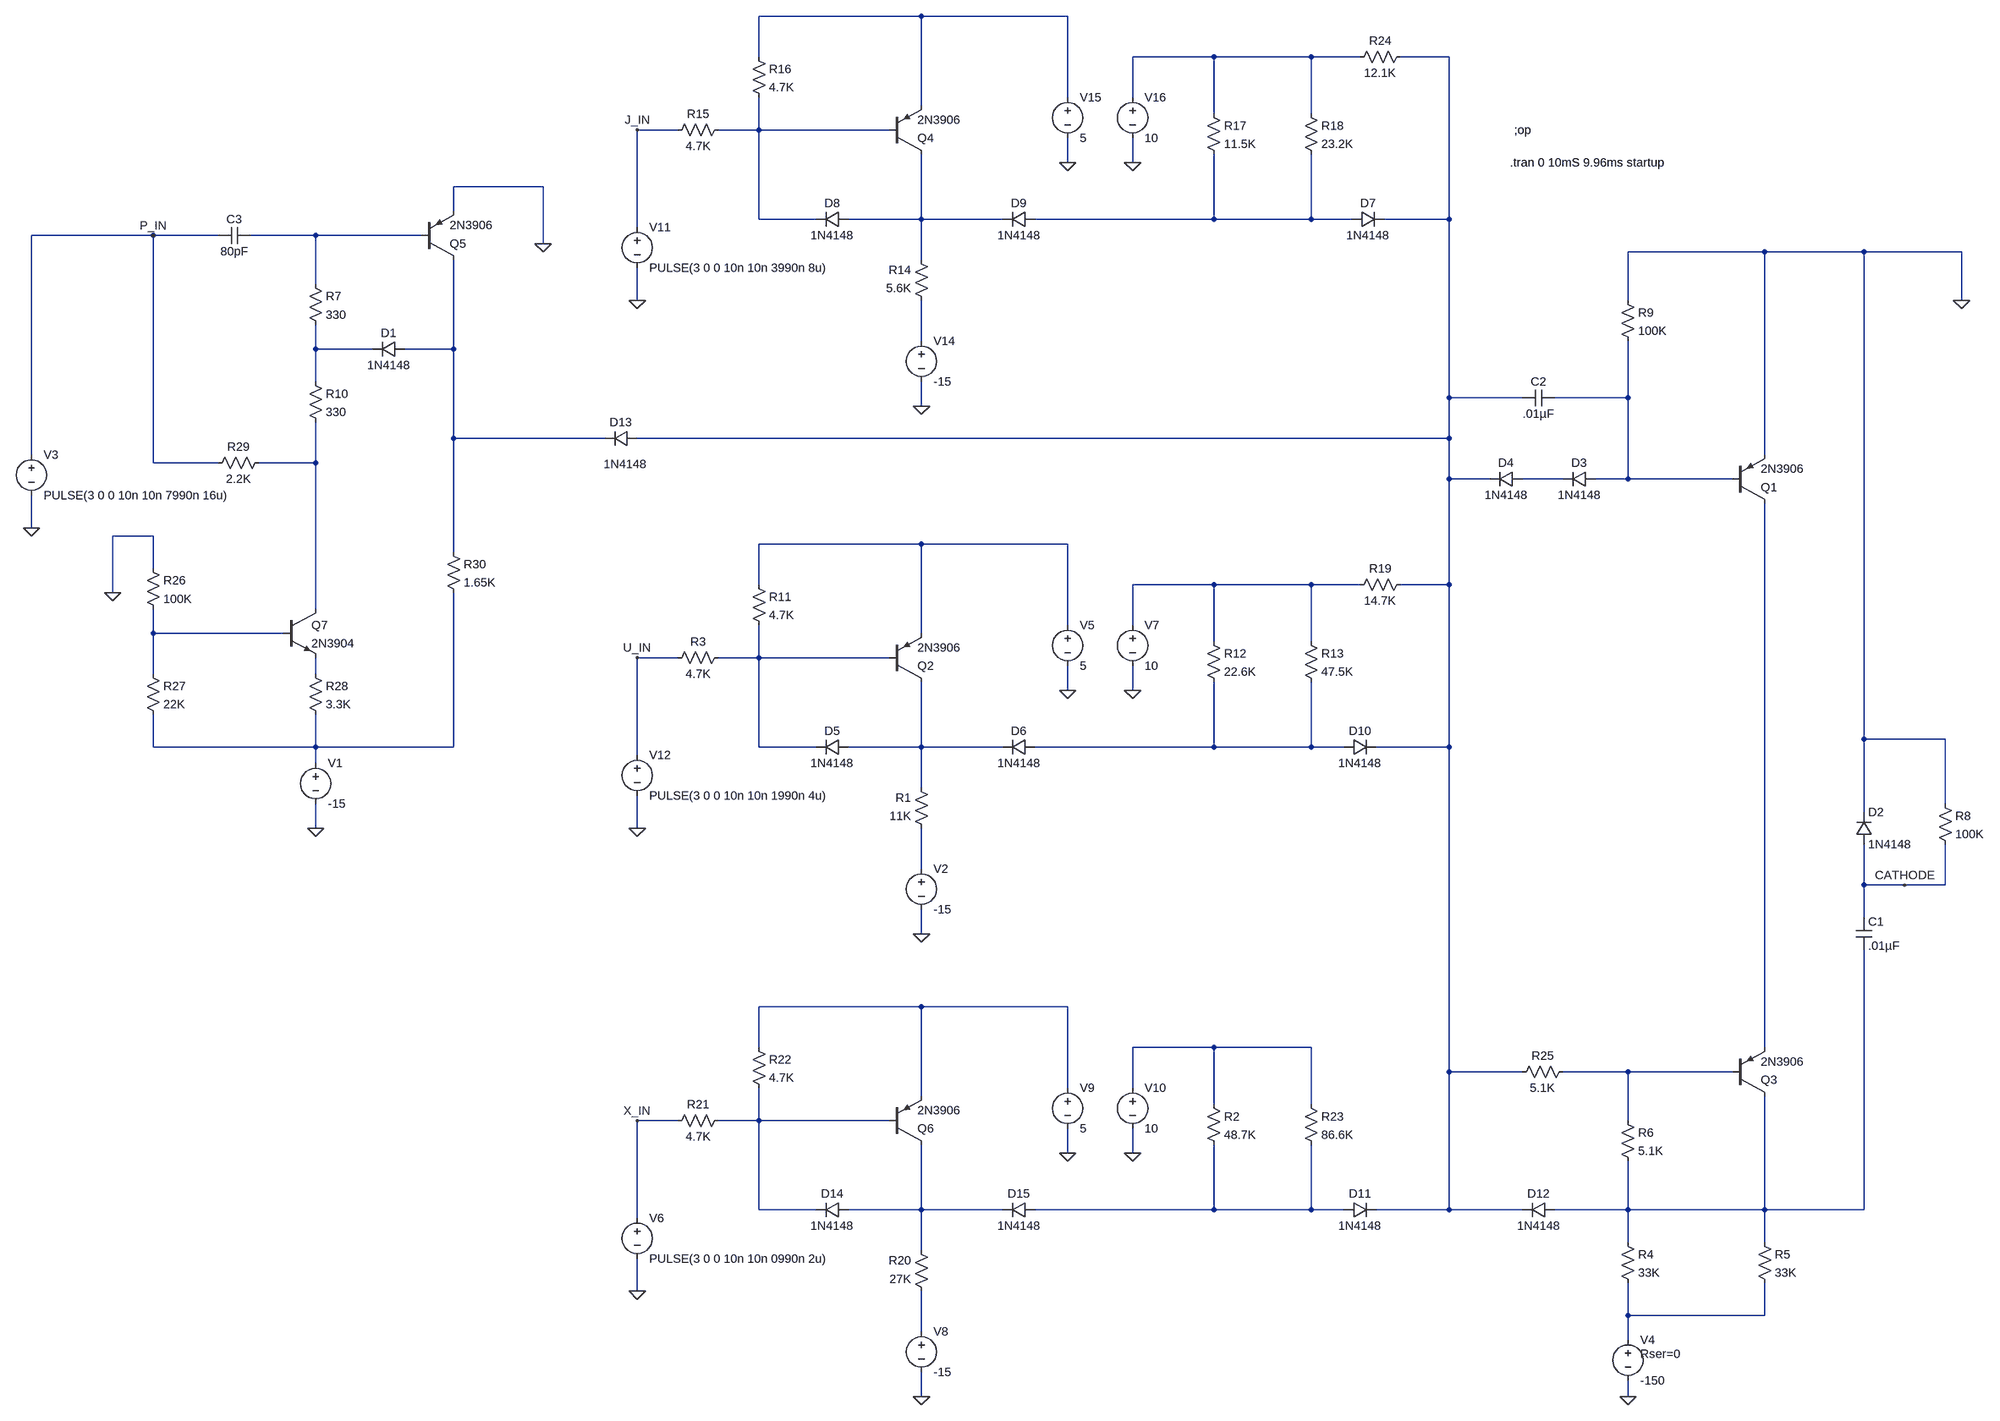
[diagram p0: schematic mimic_1705_intensifier.asc]
mimic_1705_intensifier.asc, the LTspice schematic file:
Version 4
SHEET 1 3236 1556
WIRE -464 -1184 -784 -1184
WIRE -176 -1184 -464 -1184
WIRE -784 -1104 -784 -1184
WIRE 112 -1104 -48 -1104
WIRE 304 -1104 112 -1104
WIRE 400 -1104 304 -1104
WIRE 576 -1104 480 -1104
WIRE -176 -1024 -176 -1184
WIRE -48 -1024 -48 -1104
WIRE -464 -1008 -464 -1184
WIRE 112 -992 112 -1104
WIRE 304 -992 304 -1104
WIRE -944 -960 -1024 -960
WIRE -784 -960 -784 -1024
WIRE -784 -960 -864 -960
WIRE -528 -960 -784 -960
WIRE -176 -896 -176 -944
WIRE -48 -896 -48 -944
WIRE -1408 -848 -1584 -848
WIRE -1584 -800 -1584 -848
WIRE -784 -784 -784 -960
WIRE -672 -784 -784 -784
WIRE -464 -784 -464 -912
WIRE -464 -784 -608 -784
WIRE -304 -784 -464 -784
WIRE 112 -784 112 -912
WIRE 112 -784 -240 -784
WIRE 304 -784 304 -912
WIRE 304 -784 112 -784
WIRE 384 -784 304 -784
WIRE 576 -784 576 -1104
WIRE 576 -784 448 -784
WIRE -1024 -768 -1024 -960
WIRE -2176 -752 -2416 -752
WIRE -2048 -752 -2176 -752
WIRE -1856 -752 -1984 -752
WIRE -1648 -752 -1856 -752
WIRE -1408 -736 -1408 -848
WIRE 1216 -720 928 -720
WIRE 1680 -720 1216 -720
WIRE 1872 -720 1680 -720
WIRE -464 -704 -464 -784
WIRE -1856 -656 -1856 -752
WIRE -1024 -624 -1024 -688
WIRE 928 -624 928 -720
WIRE 1872 -624 1872 -720
WIRE -464 -544 -464 -624
WIRE -1856 -528 -1856 -576
WIRE -1744 -528 -1856 -528
WIRE -1584 -528 -1584 -704
WIRE -1584 -528 -1680 -528
WIRE -1856 -464 -1856 -528
WIRE 576 -432 576 -784
WIRE 720 -432 576 -432
WIRE 928 -432 928 -544
WIRE 928 -432 784 -432
WIRE -464 -416 -464 -464
WIRE -1584 -352 -1584 -528
WIRE -1088 -352 -1584 -352
WIRE 576 -352 576 -432
WIRE 576 -352 -1024 -352
WIRE -2416 -320 -2416 -752
WIRE 1216 -320 1216 -720
WIRE -2176 -304 -2176 -752
WIRE -2048 -304 -2176 -304
WIRE -1856 -304 -1856 -384
WIRE -1856 -304 -1968 -304
WIRE 576 -272 576 -352
WIRE 656 -272 576 -272
WIRE 800 -272 720 -272
WIRE 928 -272 928 -432
WIRE 928 -272 864 -272
WIRE 1152 -272 928 -272
WIRE -2416 -176 -2416 -240
WIRE -2176 -160 -2256 -160
WIRE -464 -144 -784 -144
WIRE -176 -144 -464 -144
WIRE -1584 -128 -1584 -352
WIRE -2176 -96 -2176 -160
WIRE -784 -64 -784 -144
WIRE 112 -64 -48 -64
WIRE 304 -64 112 -64
WIRE 400 -64 304 -64
WIRE 576 -64 576 -272
WIRE 576 -64 480 -64
WIRE -2256 -48 -2256 -160
WIRE -1856 -16 -1856 -304
WIRE -176 16 -176 -144
WIRE -48 16 -48 -64
WIRE -2176 32 -2176 -16
WIRE -1920 32 -2176 32
WIRE -464 32 -464 -144
WIRE 112 48 112 -64
WIRE 304 48 304 -64
WIRE -944 80 -1024 80
WIRE -784 80 -784 16
WIRE -784 80 -864 80
WIRE -528 80 -784 80
WIRE -2176 112 -2176 32
WIRE -1856 112 -1856 80
WIRE -176 144 -176 96
WIRE -48 144 -48 96
WIRE 1680 240 1680 -720
WIRE 1840 240 1680 240
WIRE -2176 256 -2176 192
WIRE -1856 256 -1856 192
WIRE -1856 256 -2176 256
WIRE -1584 256 -1584 -48
WIRE -1584 256 -1856 256
WIRE -784 256 -784 80
WIRE -672 256 -784 256
WIRE -464 256 -464 128
WIRE -464 256 -608 256
WIRE -304 256 -464 256
WIRE 112 256 112 128
WIRE 112 256 -240 256
WIRE 304 256 304 128
WIRE 304 256 112 256
WIRE 368 256 304 256
WIRE 576 256 576 -64
WIRE 576 256 432 256
WIRE -1024 272 -1024 80
WIRE -1856 288 -1856 256
WIRE -464 336 -464 256
WIRE 1840 368 1840 240
WIRE 1680 384 1680 240
WIRE -1856 416 -1856 368
WIRE -1024 416 -1024 352
WIRE -464 496 -464 416
WIRE 1680 528 1680 448
WIRE 1760 528 1680 528
WIRE 1840 528 1840 448
WIRE 1840 528 1760 528
WIRE 1680 592 1680 528
WIRE -464 624 -464 576
WIRE -464 768 -784 768
WIRE -176 768 -464 768
WIRE -784 848 -784 768
WIRE 112 848 -48 848
WIRE 304 848 112 848
WIRE 1216 848 1216 -224
WIRE 576 896 576 256
WIRE 720 896 576 896
WIRE 928 896 800 896
WIRE 1152 896 928 896
WIRE -176 928 -176 768
WIRE -48 928 -48 848
WIRE -464 944 -464 768
WIRE 112 960 112 848
WIRE 304 960 304 848
WIRE -944 992 -1024 992
WIRE -784 992 -784 928
WIRE -784 992 -864 992
WIRE -528 992 -784 992
WIRE 928 992 928 896
WIRE -176 1056 -176 1008
WIRE -48 1056 -48 1008
WIRE -784 1168 -784 992
WIRE -672 1168 -784 1168
WIRE -464 1168 -464 1040
WIRE -464 1168 -608 1168
WIRE -304 1168 -464 1168
WIRE 112 1168 112 1040
WIRE 112 1168 -240 1168
WIRE 304 1168 304 1040
WIRE 304 1168 112 1168
WIRE 368 1168 304 1168
WIRE 576 1168 576 896
WIRE 576 1168 432 1168
WIRE 720 1168 576 1168
WIRE 928 1168 928 1072
WIRE 928 1168 784 1168
WIRE 1216 1168 1216 944
WIRE 1216 1168 928 1168
WIRE 1680 1168 1680 656
WIRE 1680 1168 1216 1168
WIRE -1024 1184 -1024 992
WIRE 928 1232 928 1168
WIRE 1216 1232 1216 1168
WIRE -464 1248 -464 1168
WIRE -1024 1328 -1024 1264
WIRE 928 1376 928 1312
WIRE 1216 1376 1216 1312
WIRE 1216 1376 928 1376
WIRE -464 1408 -464 1328
WIRE 928 1424 928 1376
WIRE -464 1536 -464 1488
WIRE 928 1536 928 1504
FLAG 928 1536 0
FLAG 1872 -624 0
FLAG -1024 1328 0
FLAG -464 1536 0
FLAG -176 1056 0
FLAG -48 1056 0
FLAG -1024 416 0
FLAG -464 624 0
FLAG -176 144 0
FLAG -48 144 0
FLAG -1024 -624 0
FLAG -464 -416 0
FLAG -176 -896 0
FLAG -48 -896 0
FLAG -1856 416 0
FLAG -2256 -48 0
FLAG -1408 -736 0
FLAG -2416 -176 0
FLAG -1024 80 U_IN
FLAG -2176 -752 P_IN
FLAG -1024 -960 J_IN
FLAG -1024 992 X_IN
FLAG 1760 528 CATHODE
SYMBOL pnp 1152 -224 M180
SYMATTR InstName Q1
SYMATTR Value 2N3906
SYMBOL pnp 1152 944 M180
SYMATTR InstName Q3
SYMATTR Value 2N3906
SYMBOL res 912 1216 R0
SYMATTR InstName R4
SYMATTR Value 33K
SYMBOL res 1200 1216 R0
SYMATTR InstName R5
SYMATTR Value 33K
SYMBOL res 912 976 R0
SYMATTR InstName R6
SYMATTR Value 5.1K
SYMBOL cap 1664 592 R0
SYMATTR InstName C1
SYMATTR Value .01µF
SYMBOL res 1824 352 R0
SYMATTR InstName R8
SYMATTR Value 100K
SYMBOL diode 1664 448 M180
WINDOW 0 24 64 Left 2
WINDOW 3 24 0 Left 2
SYMATTR InstName D2
SYMATTR Value 1N4148
SYMBOL diode 864 -288 R90
WINDOW 0 0 32 VBottom 2
WINDOW 3 32 32 VTop 2
SYMATTR InstName D3
SYMATTR Value 1N4148
SYMBOL diode 720 -288 R90
WINDOW 0 0 32 VBottom 2
WINDOW 3 32 32 VTop 2
SYMATTR InstName D4
SYMATTR Value 1N4148
SYMBOL cap 784 -448 R90
WINDOW 0 0 32 VBottom 2
WINDOW 3 32 32 VTop 2
SYMATTR InstName C2
SYMATTR Value .01µF
SYMBOL res 912 -640 R0
SYMATTR InstName R9
SYMATTR Value 100K
SYMBOL voltage 928 1408 R0
WINDOW 123 0 0 Left 2
WINDOW 39 24 44 Left 2
SYMATTR SpiceLine Rser=0
SYMATTR InstName V4
SYMATTR Value -150
SYMBOL diode 384 -768 R270
WINDOW 0 32 32 VTop 2
WINDOW 3 0 32 VBottom 2
SYMATTR InstName D7
SYMATTR Value 1N4148
SYMBOL voltage -1024 1168 R0
WINDOW 123 0 0 Left 2
WINDOW 39 0 0 Left 2
SYMATTR InstName V6
SYMATTR Value PULSE(3 0 0 10n 10n 0990n 2u)
SYMBOL res -448 1344 R180
WINDOW 0 36 76 Left 2
WINDOW 3 36 40 Left 2
SYMATTR InstName R20
SYMATTR Value 27K
SYMBOL diode -608 1152 R90
WINDOW 0 0 32 VBottom 2
WINDOW 3 32 32 VTop 2
SYMATTR InstName D14
SYMATTR Value 1N4148
SYMBOL diode -240 1152 R90
WINDOW 0 0 32 VBottom 2
WINDOW 3 32 32 VTop 2
SYMATTR InstName D15
SYMATTR Value 1N4148
SYMBOL pnp -528 1040 M180
SYMATTR InstName Q6
SYMATTR Value 2N3906
SYMBOL res -848 976 R90
WINDOW 0 0 56 VBottom 2
WINDOW 3 32 56 VTop 2
SYMATTR InstName R21
SYMATTR Value 4.7K
SYMBOL res -800 832 R0
SYMATTR InstName R22
SYMATTR Value 4.7K
SYMBOL voltage -464 1392 R0
WINDOW 123 0 0 Left 2
WINDOW 39 0 0 Left 2
SYMATTR InstName V8
SYMATTR Value -15
SYMBOL voltage -176 912 R0
WINDOW 123 0 0 Left 2
WINDOW 39 0 0 Left 2
SYMATTR InstName V9
SYMATTR Value 5
SYMBOL res 96 944 R0
SYMATTR InstName R2
SYMATTR Value 48.7K
SYMBOL res 288 944 R0
SYMATTR InstName R23
SYMATTR Value 86.6K
SYMBOL voltage -48 912 R0
WINDOW 123 0 0 Left 2
WINDOW 39 0 0 Left 2
SYMATTR InstName V10
SYMATTR Value 10
SYMBOL voltage -1024 -784 R0
WINDOW 123 0 0 Left 2
WINDOW 39 0 0 Left 2
SYMATTR InstName V11
SYMATTR Value PULSE(3 0 0 10n 10n 3990n 8u)
SYMBOL voltage -1024 256 R0
WINDOW 123 0 0 Left 2
WINDOW 39 0 0 Left 2
SYMATTR InstName V12
SYMATTR Value PULSE(3 0 0 10n 10n 1990n 4u)
SYMBOL res -448 432 R180
WINDOW 0 36 76 Left 2
WINDOW 3 36 40 Left 2
SYMATTR InstName R1
SYMATTR Value 11K
SYMBOL diode -608 240 R90
WINDOW 0 0 32 VBottom 2
WINDOW 3 32 32 VTop 2
SYMATTR InstName D5
SYMATTR Value 1N4148
SYMBOL diode -240 240 R90
WINDOW 0 0 32 VBottom 2
WINDOW 3 32 32 VTop 2
SYMATTR InstName D6
SYMATTR Value 1N4148
SYMBOL pnp -528 128 M180
SYMATTR InstName Q2
SYMATTR Value 2N3906
SYMBOL res -848 64 R90
WINDOW 0 0 56 VBottom 2
WINDOW 3 32 56 VTop 2
SYMATTR InstName R3
SYMATTR Value 4.7K
SYMBOL res -800 -80 R0
SYMATTR InstName R11
SYMATTR Value 4.7K
SYMBOL voltage -464 480 R0
WINDOW 123 0 0 Left 2
WINDOW 39 0 0 Left 2
SYMATTR InstName V2
SYMATTR Value -15
SYMBOL voltage -176 0 R0
WINDOW 123 0 0 Left 2
WINDOW 39 0 0 Left 2
SYMATTR InstName V5
SYMATTR Value 5
SYMBOL res 96 32 R0
SYMATTR InstName R12
SYMATTR Value 22.6K
SYMBOL res 288 32 R0
SYMATTR InstName R13
SYMATTR Value 47.5K
SYMBOL voltage -48 0 R0
WINDOW 123 0 0 Left 2
WINDOW 39 0 0 Left 2
SYMATTR InstName V7
SYMATTR Value 10
SYMBOL res -448 -608 R180
WINDOW 0 36 76 Left 2
WINDOW 3 36 40 Left 2
SYMATTR InstName R14
SYMATTR Value 5.6K
SYMBOL diode -608 -800 R90
WINDOW 0 0 32 VBottom 2
WINDOW 3 32 32 VTop 2
SYMATTR InstName D8
SYMATTR Value 1N4148
SYMBOL diode -240 -800 R90
WINDOW 0 0 32 VBottom 2
WINDOW 3 32 32 VTop 2
SYMATTR InstName D9
SYMATTR Value 1N4148
SYMBOL pnp -528 -912 M180
SYMATTR InstName Q4
SYMATTR Value 2N3906
SYMBOL res -848 -976 R90
WINDOW 0 0 56 VBottom 2
WINDOW 3 32 56 VTop 2
SYMATTR InstName R15
SYMATTR Value 4.7K
SYMBOL res -800 -1120 R0
SYMATTR InstName R16
SYMATTR Value 4.7K
SYMBOL voltage -464 -560 R0
WINDOW 123 0 0 Left 2
WINDOW 39 0 0 Left 2
SYMATTR InstName V14
SYMATTR Value -15
SYMBOL voltage -176 -1040 R0
WINDOW 123 0 0 Left 2
WINDOW 39 0 0 Left 2
SYMATTR InstName V15
SYMATTR Value 5
SYMBOL res 96 -1008 R0
SYMATTR InstName R17
SYMATTR Value 11.5K
SYMBOL res 288 -1008 R0
SYMATTR InstName R18
SYMATTR Value 23.2K
SYMBOL voltage -48 -1040 R0
WINDOW 123 0 0 Left 2
WINDOW 39 0 0 Left 2
SYMATTR InstName V16
SYMATTR Value 10
SYMBOL diode 368 272 R270
WINDOW 0 32 32 VTop 2
WINDOW 3 0 32 VBottom 2
SYMATTR InstName D10
SYMATTR Value 1N4148
SYMBOL diode 368 1184 R270
WINDOW 0 32 32 VTop 2
WINDOW 3 0 32 VBottom 2
SYMATTR InstName D11
SYMATTR Value 1N4148
SYMBOL res 496 -80 R90
WINDOW 0 0 56 VBottom 2
WINDOW 3 32 56 VTop 2
SYMATTR InstName R19
SYMATTR Value 14.7K
SYMBOL res 496 -1120 R90
WINDOW 0 0 56 VBottom 2
WINDOW 3 32 56 VTop 2
SYMATTR InstName R24
SYMATTR Value 12.1K
SYMBOL diode 784 1152 R90
WINDOW 0 0 32 VBottom 2
WINDOW 3 32 32 VTop 2
SYMATTR InstName D12
SYMATTR Value 1N4148
SYMBOL res 816 880 R90
WINDOW 0 0 56 VBottom 2
WINDOW 3 32 56 VTop 2
SYMATTR InstName R25
SYMATTR Value 5.1K
SYMBOL pnp -1648 -704 M180
SYMATTR InstName Q5
SYMATTR Value 2N3906
SYMBOL res -1872 -672 R0
SYMATTR InstName R7
SYMATTR Value 330
SYMBOL res -1872 -480 R0
SYMATTR InstName R10
SYMATTR Value 330
SYMBOL res -2192 -112 R0
SYMATTR InstName R26
SYMATTR Value 100K
SYMBOL res -2192 96 R0
SYMATTR InstName R27
SYMATTR Value 22K
SYMBOL npn -1920 -16 R0
SYMATTR InstName Q7
SYMATTR Value 2N3904
SYMBOL voltage -1856 272 R0
WINDOW 123 0 0 Left 2
WINDOW 39 0 0 Left 2
SYMATTR InstName V1
SYMATTR Value -15
SYMBOL res -1872 96 R0
SYMATTR InstName R28
SYMATTR Value 3.3K
SYMBOL res -1952 -320 R90
WINDOW 0 0 56 VBottom 2
WINDOW 3 32 56 VTop 2
SYMATTR InstName R29
SYMATTR Value 2.2K
SYMBOL cap -1984 -768 R90
WINDOW 0 0 32 VBottom 2
WINDOW 3 32 32 VTop 2
SYMATTR InstName C3
SYMATTR Value 80pF
SYMBOL res -1600 -144 R0
SYMATTR InstName R30
SYMATTR Value 1.65K
SYMBOL diode -1680 -544 R90
WINDOW 0 0 32 VBottom 2
WINDOW 3 32 32 VTop 2
SYMATTR InstName D1
SYMATTR Value 1N4148
SYMBOL diode -1024 -368 R90
WINDOW 0 0 32 VBottom 2
WINDOW 3 51 24 VTop 2
SYMATTR InstName D13
SYMATTR Value 1N4148
SYMBOL voltage -2416 -336 R0
WINDOW 123 0 0 Left 2
WINDOW 39 0 0 Left 2
SYMATTR InstName V3
SYMATTR Value PULSE(3 0 0 10n 10n 7990n 16u)
TEXT 704 -960 Left 2 !;op
TEXT 696 -896 Left 2 !.tran 0 10mS 9.96ms startup

The netlist it stands for:
* mimic_1705_intensifier.asc
Q1 N025 N011 0 0 2N3906
Q3 N030 N026 N025 0 2N3906
R4 N030 N031 33K
R5 N030 N031 33K
R6 N026 N030 5.1K
C1 CATHODE N030 .01µF
R8 0 CATHODE 100K
D2 CATHODE 0 1N4148
D3 N011 N013 1N4148
D4 N013 N003 1N4148
C2 N011 N003 .01µF
R9 0 N011 100K
V4 N031 0 -150 Rser=0
D7 N006 N003 1N4148
V6 X_IN 0 PULSE(3 0 0 10n 10n 0990n 2u)
R20 N032 N028 27K
D14 N028 N027 1N4148
D15 N029 N028 1N4148
Q6 N028 N027 N023 0 2N3906
R21 N027 X_IN 4.7K
R22 N023 N027 4.7K
V8 N032 0 -15
V9 N023 0 5
R2 N024 N029 48.7K
R23 N024 N029 86.6K
V10 N024 0 10
V11 J_IN 0 PULSE(3 0 0 10n 10n 3990n 8u)
V12 U_IN 0 PULSE(3 0 0 10n 10n 1990n 4u)
R1 N022 N020 11K
D5 N020 N017 1N4148
D6 N021 N020 1N4148
Q2 N020 N017 N014 0 2N3906
R3 N017 U_IN 4.7K
R11 N014 N017 4.7K
V2 N022 0 -15
V5 N014 0 5
R12 N015 N021 22.6K
R13 N015 N021 47.5K
V7 N015 0 10
R14 N008 N005 5.6K
D8 N005 N004 1N4148
D9 N006 N005 1N4148
Q4 N005 N004 N001 0 2N3906
R15 N004 J_IN 4.7K
R16 N001 N004 4.7K
V14 N008 0 -15
V15 N001 0 5
R17 N002 N006 11.5K
R18 N002 N006 23.2K
V16 N002 0 10
D10 N021 N003 1N4148
D11 N029 N003 1N4148
R19 N003 N015 14.7K
R24 N003 N002 12.1K
D12 N030 N003 1N4148
R25 N026 N003 5.1K
Q5 N010 N007 0 0 2N3906
R7 N007 N009 330
R10 N009 N012 330
R26 0 N016 100K
R27 N016 N019 22K
Q7 N012 N016 N018 0 2N3904
V1 N019 0 -15
R28 N018 N019 3.3K
R29 N012 P_IN 2.2K
C3 N007 P_IN 80pF
R30 N010 N019 1.65K
D1 N010 N009 1N4148
D13 N003 N010 1N4148
V3 P_IN 0 PULSE(3 0 0 10n 10n 7990n 16u)
.model D D
.lib standard.dio
.model NPN NPN
.model PNP PNP
.lib standard.bjt
;op
.tran 0 10mS 9.96ms startup
.backanno
.end